# EAGLE design rapidshark-battery-conn-mk-1.1 (EAGLE 6.5.0)
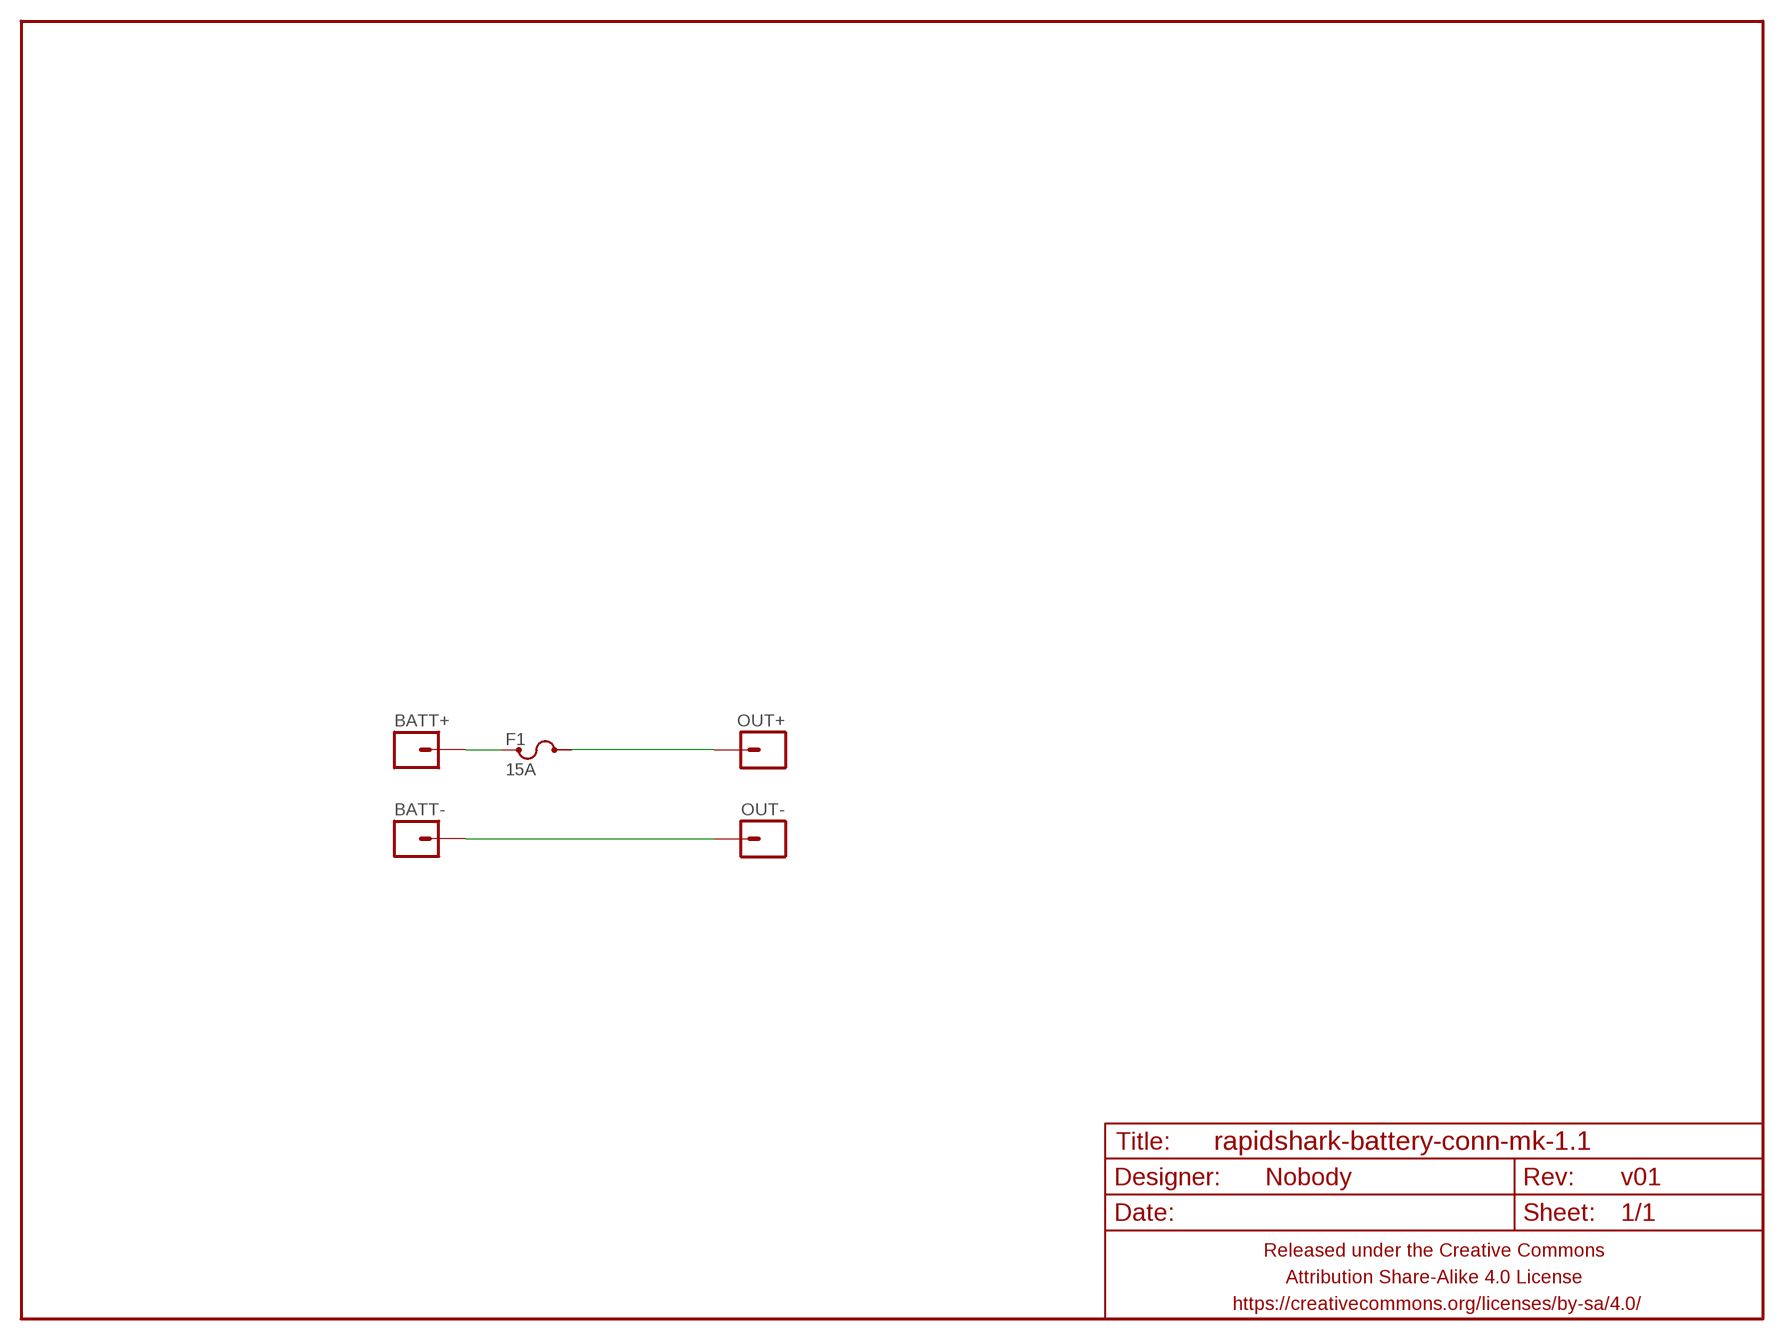
[diagram p0: schematic, sheet 1]

## Parts
BATT+  M01PTH-2.3MM  [1X01-2.3MM]
BATT-  M01PTH-2.3MM  [1X01-2.3MM]
F1  15A  FUSEMINI-AUTO  [KEYSTONE-MINI-AUTO-FUSE-HOLDER]
FRAME1  FRAME-LETTERNO_PACKAGE  [DUMMY]
OUT+  M0112AWG  [1X01-12AWG]
OUT-  M0112AWG  [1X01-12AWG]

## Nets
BATT+: BATT+.1 F1.P1@1 F1.P1@2
BATT-: BATT-.1 OUT-.1
OUT+: F1.P2@1 F1.P2@2 OUT+.1

## Library data of the parts
BATT+ BATT- OUT+ OUT- = A_butts:M01: Header 1 Standard 1-pin 0.1" header. Use with straight break away headers (SKU : PRT-00116), right angle break away headers (PRT-00553), swiss pins (PRT-00743), machine pins (PRT-00117), and female headers (PRT-00115).
F1 = A_butts:FUSE
FRAME1 = A_butts:FRAME-LETTER: Schematic Frame Standard 8.5x11 US Letter frame; DESIGNER: Nobody; VERSION: v01

## Board
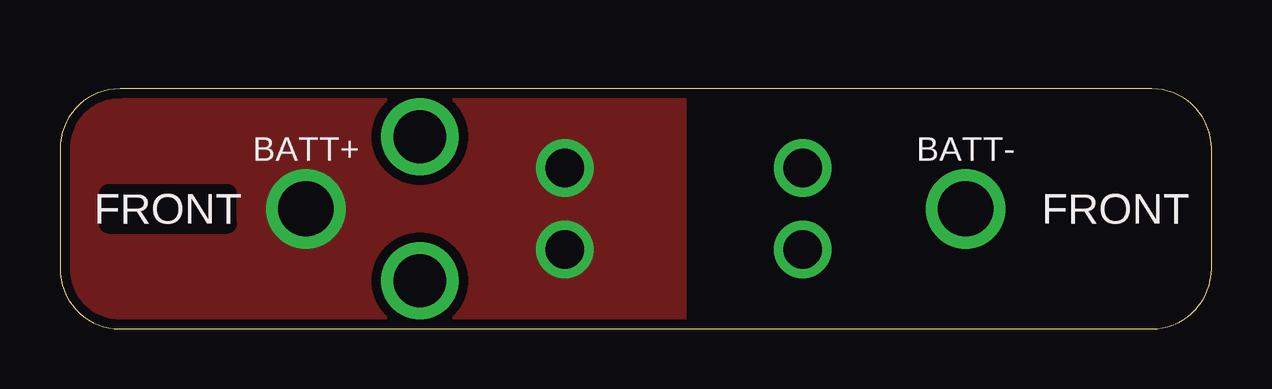
[diagram p1: board, top side]
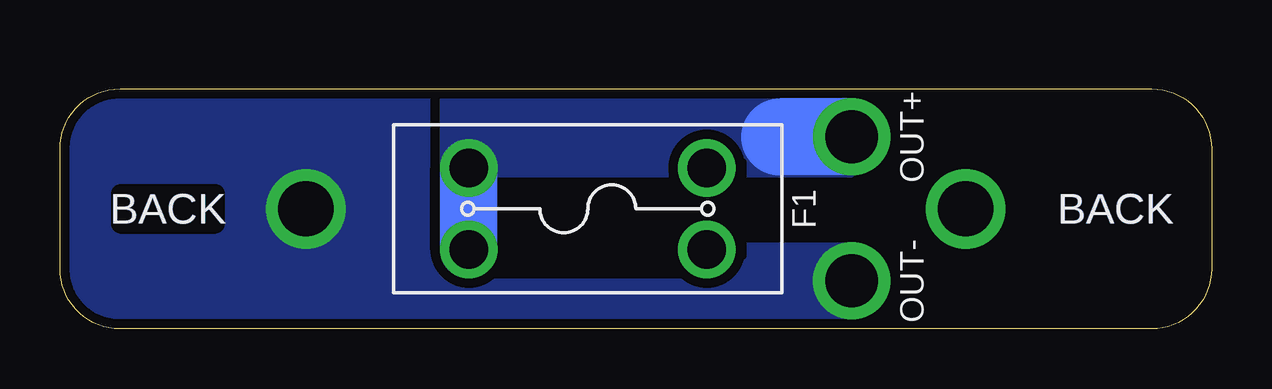
[diagram p2: board, bottom side, seen from below]

Size 48 x 10 mm. Coordinates in mm from the lower left corner, seen from the top.
Outline: 0,7.5 0,2.5 arc90 2.5,0 45.5,0 arc90 48,2.5 48,7.5 arc90 45.5,10 2.5,10 arc90 0,7.5
Copper layers (1*16): Top 0.0356mm / dielectric 1.5011mm / Bottom 0.0356mm
Design rules "LaenPCBOrder_2": minimum track width 6mil, minimum drill 13mil, track to track 6mil, track to pad 6mil, pad to pad 6mil, via to via 6mil, smd to smd 6mil, copper to edge 15mil, drill to drill 6mil, minimum pad ring 7mil, minimum via ring 7mil, stop-mask expansion 3mil, vias tented up to drill 20mil, thermal gap 10mil

### Footprints (pad centres in the part's own frame; a part is rotated, then mirrored left to right if it is on the bottom)
1X01-2.3MM = drill 2.3 pad 3.3: 1 0,0
KEYSTONE-MINI-AUTO-FUSE-HOLDER = drill 1.6: P1@1 -4.96,1.7; P1@2 -4.96,-1.7; P2@1 4.96,1.7; P2@2 4.96,-1.7
1X01-12AWG = drill 2.2 pad 3.2: 1 0,0

### Placement (x,y rotation side)
BATT+  10.25,5 0 top
BATT-  37.75,5 0 top
F1  26,5 180 bottom
FRAME1  0,0 0 top
OUT+  15,8 270 bottom
OUT-  15,2 270 bottom

### Tracks (layer width: path | path; a pad name or v marks a point on that pad's centre or on a via)
BATT+
  pour Top (isolate 0.4, no thermals): 26,0 0,0 0,10 26,10
BATT-
  pour Bottom (isolate 0.4, rank 5, no thermals): 32,10 32,2 20,2 20,3.5 15,3.5 15,3 14,3 14,1 15,1 15,0 48,0 48,10
N$1
  cutout Bottom (rank 5, no thermals): 19.5,7 19.5,3 22.5,3 22.5,7
OUT+
  Bottom 2.4: F1.P2@1 F1.P2@2
  Bottom 3.2: OUT+.1 18,8
  pour Bottom (isolate 0.4, no thermals): 15,10 15,6.4 32.06,6.4 32.06,10

### Text on the board
Top: FRONT | FRONT
Bottom: BACK | BACK
tPlace: FRONT | FRONT
bPlace: BACK | BACK